# EAGLE design CNC Power V2[Конфликт] (EAGLE 7.5.0)
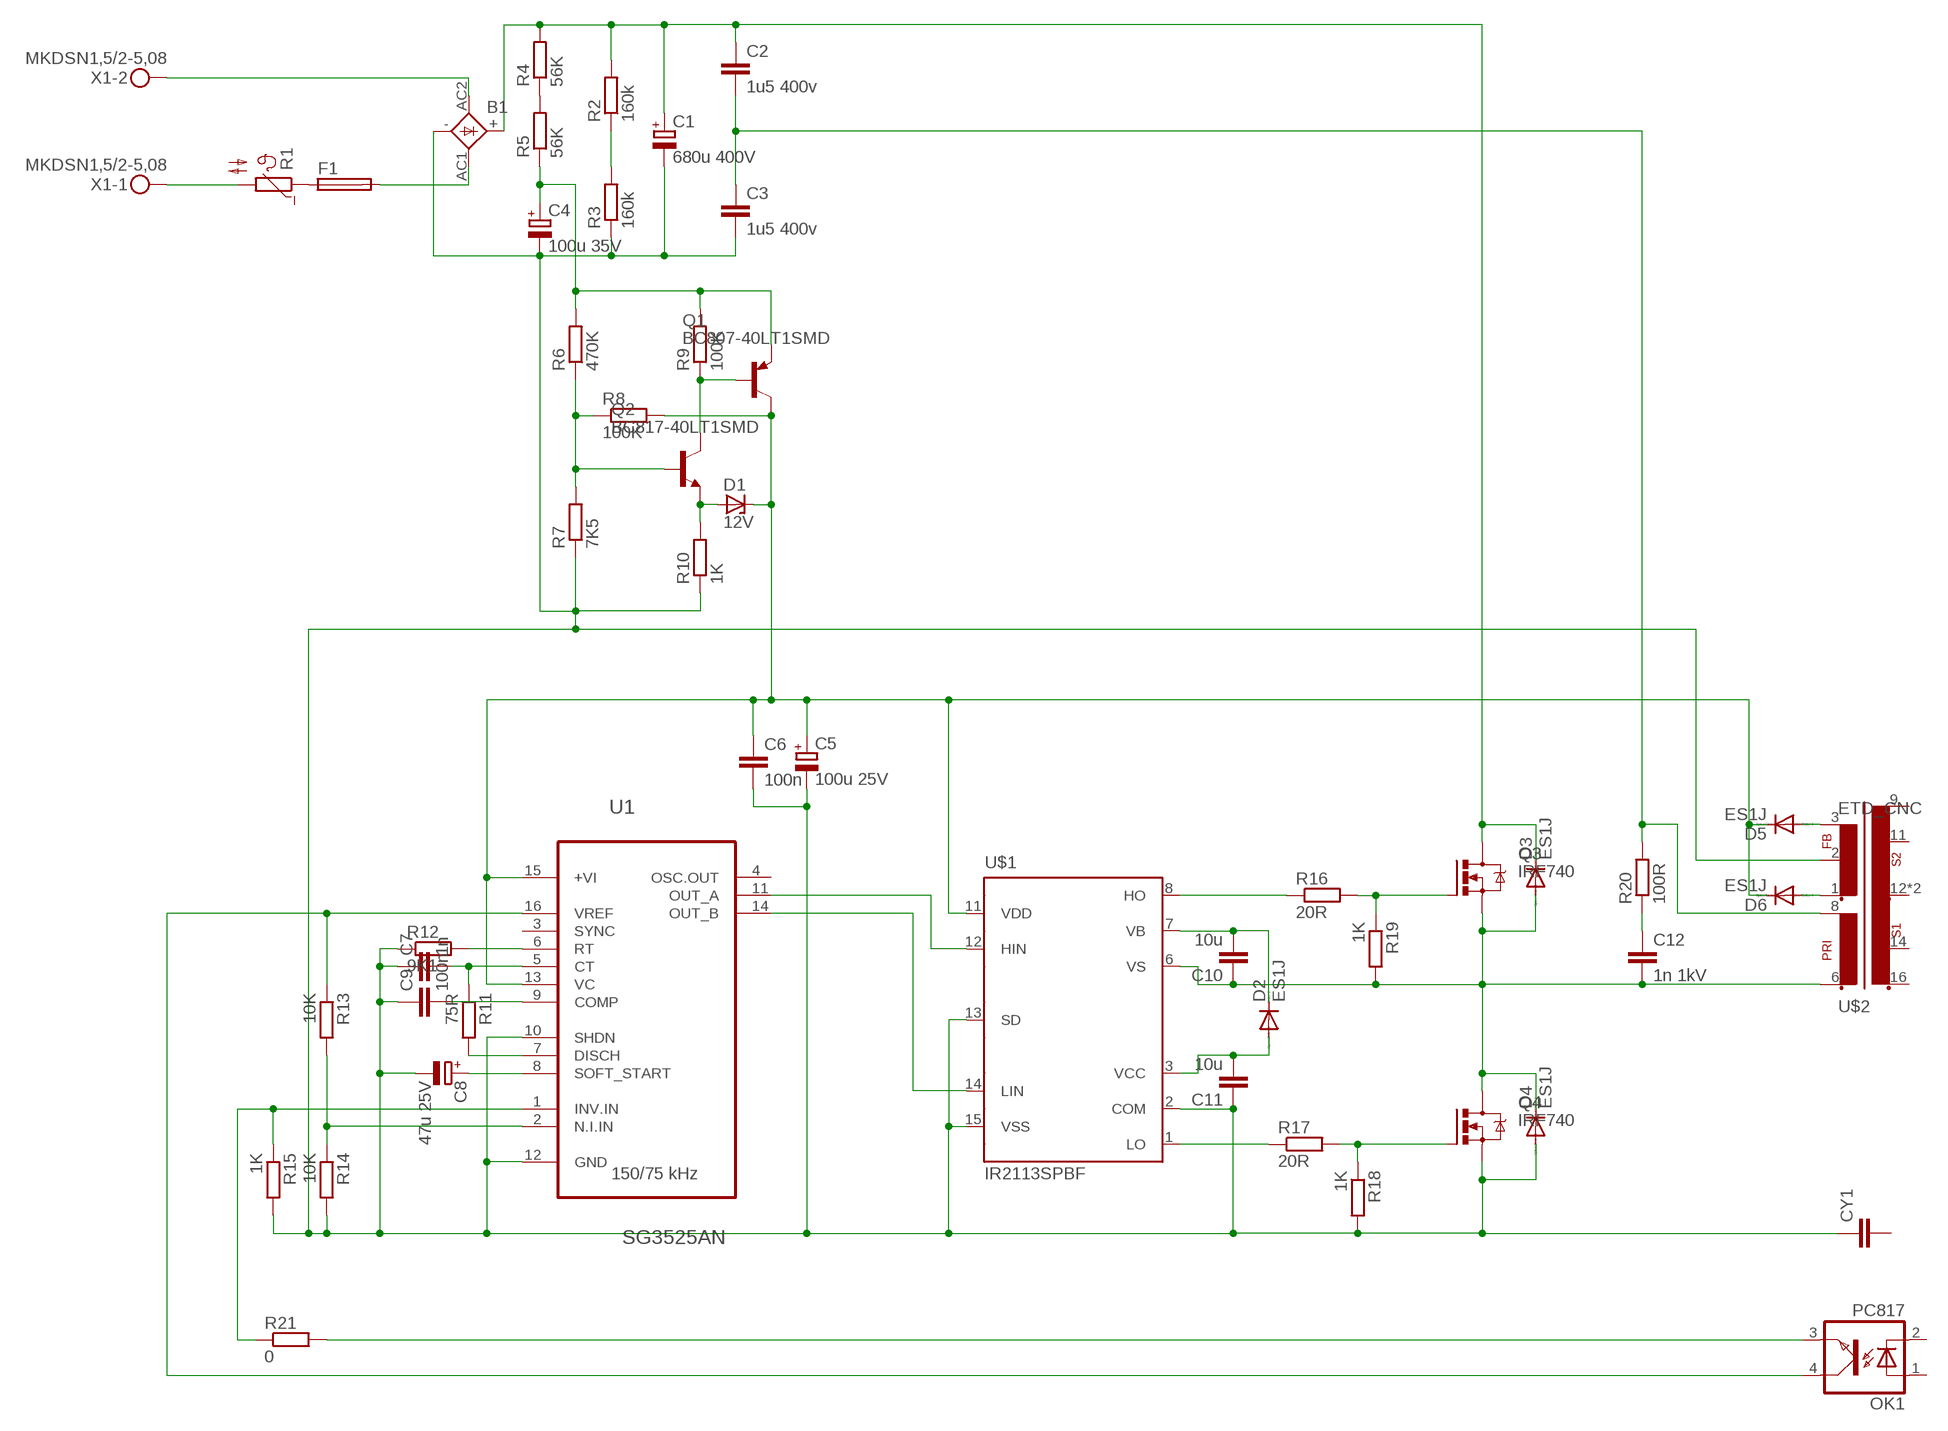
[diagram p0: schematic, sheet 1]

## Parts
B1  KBL  [KBL]
C1  680u 400V  CPOL-EUE10-35  [EB35D]
C2  1u5 400v  C-EU225-074X268  [C225-074X268]
C3  1u5 400v  C-EU225-074X268  [C225-074X268]
C4  100u 35V  CPOL-EUE2.5-7  [E2,5-7]
C5  100u 25V  CPOL-EUE2.5-7  [E2,5-7]
C6  100n  C-EUC0805  [C0805]
C7  1n  C-EUC0805  [C0805]
C8  47u 25V  CPOL-EUE2.5-7  [E2,5-7]
C9  100n  C-EUC0805  [C0805]
C10  10u  C-EUC0805  [C0805]
C11  10u  C-EUC0805  [C0805]
C12  1n 1kV  C-EU050-025X075  [C050-025X075]
CY1  CYYC10B4  [YC10B4]
D1  12V  ZENER-DIODESOD80C  [SOD80C]
D2  ES1J  DIODE-DO214AC  [DO214AC]
D3  ES1J  DIODE-DO214AC  [DO214AC]
D4  ES1J  DIODE-DO214AC  [DO214AC]
D5  ES1J  DIODE-DO214AC  [DO214AC]
D6  ES1J  DIODE-DO214AC  [DO214AC]
F1  SH22,5  [SH22,5]
OK1  PC817  [DIL04]
Q1  BC807-40LT1SMD  [SOT23-BEC]
Q2  BC817-40LT1SMD  [SOT23-BEC]
Q3  IRF740  [TO220BV]
Q4  IRF740  [TO220BV]
R1  B57164  [B57164]
R2  160k  R-EU_0207/10  [0207/10]
R3  160k  R-EU_0207/10  [0207/10]
R4  56K  R-EU_0617/17  [0617/17]
R5  56K  R-EU_0617/17  [0617/17]
R6  470K  R-EU_R0805  [R0805]
R7  7K5  R-EU_R0805  [R0805]
R8  100K  R-EU_R0805  [R0805]
R9  100K  R-EU_R0805  [R0805]
R10  1K  R-EU_R0805  [R0805]
R11  75R  R-EU_R0805  [R0805]
R12  9K1  R-EU_R0805  [R0805]
R13  10K  R-EU_R0805  [R0805]
R14  10K  R-EU_R0805  [R0805]
R15  1K  R-EU_R0805  [R0805]
R16  20R  R-EU_R1206  [R1206]
R17  20R  R-EU_R1206  [R1206]
R18  1K  R-EU_R0805  [R0805]
R19  1K  R-EU_R0805  [R0805]
R20  100R  R-EU_0617/17  [0617/17]
R21  0  R-EU_R1206  [R1206]
U1  SG3525AN  [DIP254P762X510-16]
U$1  IR2113SPBF  [SO16W]
U$2  ETD_CNC  [ETD39_16PIN]
X1  MKDSN1,5/2-5,08  [MKDSN1,5/2-5,08]

## Nets
12V: C5.+ C6.1 D1.C D5.C D6.C Q1.C R8.2 U1.13(VC) U1.15(+VI) U$1.11(VDD)
HV-0: B1.- C1.- C3.2 C4.- C5.- C6.2 C7.1 C8.- C9.1 C11.1 CY1.1 D4.A Q4.S R3.1 R7.1 R10.1 R12.1 R14.2 R15.2 R18.2 U1.10(SHDN) U1.12(GND) U$1.2(COM) U$1.13(SD) U$1.15(VSS) U$2.2(F0)
HV-150: C2.2 C3.1 R20.2 U$2.8(P-2)
HV-300: B1.+ C1.+ C2.1 D3.C Q3.D R2.2 R4.2
N$1: F1.1 R1.1
N$2: R1.2 X1.1
N$3: B1.AC1(AC2) F1.2
N$4: B1.AC2(AC1) X1.2
N$5: R16.1 U$1.8(HO)
N$6: R17.1 U$1.1(LO)
N$7: Q3.G R16.2 R19.1
N$8: R2.1 R3.2
N$9: R4.1 R5.2
N$10: C4.+ Q1.E R5.1 R6.2 R9.2
N$11: Q2.B R6.1 R7.2 R8.1
N$12: Q1.B Q2.C R9.1
N$13: OK1.3(EMIT) R21.2
N$14: D1.A Q2.E R10.2
N$15: C7.2 R11.1 U1.5(CT)
N$16: R11.2 U1.7(DISCH)
N$17: Q4.G R17.2 R18.1
N$18: U1.11(OUT_A) U$1.12(HIN)
N$19: U1.14(OUT_B) U$1.14(LIN)
N$20: R12.2 U1.6(RT)
N$21: C8.+ U1.8(SOFT_START)
N$22: C9.2 U1.9(COMP)
N$23: OK1.4(COL) R13.1 U1.16(VREF)
N$24: R13.2 R14.1 U1.2(N.I.IN)
N$25: R15.1 R21.1 U1.1(INV.IN)
N$28: D6.A U$2.1(F+12)
N$29: D5.A U$2.3(F-12)
N$30: C12.1 R20.1
VB: C10.2 D2.C U$1.7(VB)
VCC: C11.2 D2.A U$1.3(VCC)
VS: C10.1 C12.2 D3.A D4.C Q3.S Q4.D R19.2 U$1.6(VS) U$2.6(P-1)
Unconnected: CY1.2 OK1.1(A) OK1.2(C) U1.3(SYNC) U1.4(OSC.OUT) U$2.9(S-48) U$2.11(S-24) U$2.12(S-0) U$2.13(S-0) U$2.14(S1+24) U$2.16(S1+48)

## Notes on the sheet
- 150/75 kHz

## Library data of the parts
B1 = rectifier:KBL: DIOTEC RECTIFIER
C1 C4 C5 C8 = rcl:CPOL-EU: POLARIZED CAPACITOR, European symbol
C2 C3 C6 C7 C9-C12 = rcl:C-EU: CAPACITOR, European symbol
CY1 = rcl:CY: Y CAPACITOR for power line
D1 = diode:ZENER-DIODE: Z-Diode
D2-D6 = diode:DIODE-: DIODE
F1 = fuse:SH22,5: FUSE HOLDER grid 22,5 mm, OGN0031 8201, Schurter (Buerklin); MF: SCHURTER; MPN: 0031.8201; OC_FARNELL: 1162740; OC_NEWARK: 96F8317
OK1 = optocoupler:PC817: SHARP OPTO COUPLER; MPN: PC817X4J000F; OC_FARNELL: 9707727; OC_NEWARK: 97K7059
Q1 = transistor-pnp:BC807*: PNP Transistror
Q2 = transistor-npn:BC817*: NPN Transistor
Q3 Q4 = transistor-power:IRF740: N-CHANNEL MOS FET
R1 = ptc-ntc:B57164: SIEMENS NTC; MPN: B57164K474K52; OC_FARNELL: 9753451; OC_NEWARK: 29M3118
R2-R21 = rcl:R-EU_: RESISTOR, European symbol
U1 = ST Microelctronics_By_element14_Batch_1:SG3525AN: REGULATING PULSE WIDTH MODULATORS; MPN: SG3525AN; OC_FARNELL: 1564368; OC_NEWARK: 89K1506; PACKAGE: PDIP-16; SUPPLIER: STMICROELECTRONICS
U$1 = Namenlos:IR2113SPBF
U$2 = _Transformers:ETD_CNC
X1 = con-phoenix-508:MKDSN1,5/2-5,08: MKDSN 1,5/ 2-5,08 Printklemme Nennstrom: 13,5 A Nennspannung: 250 V Rastermaß: 5,08 mm Polzahl: 2 Anschlussart: Schraubanschluss Montage: Löten Anschlussrichtung Leiter/Platine: 0 ° Artikelnummer: 1729128 Source: http://eshop.phoenixcontact.com .. 1729128.pdf

## Board
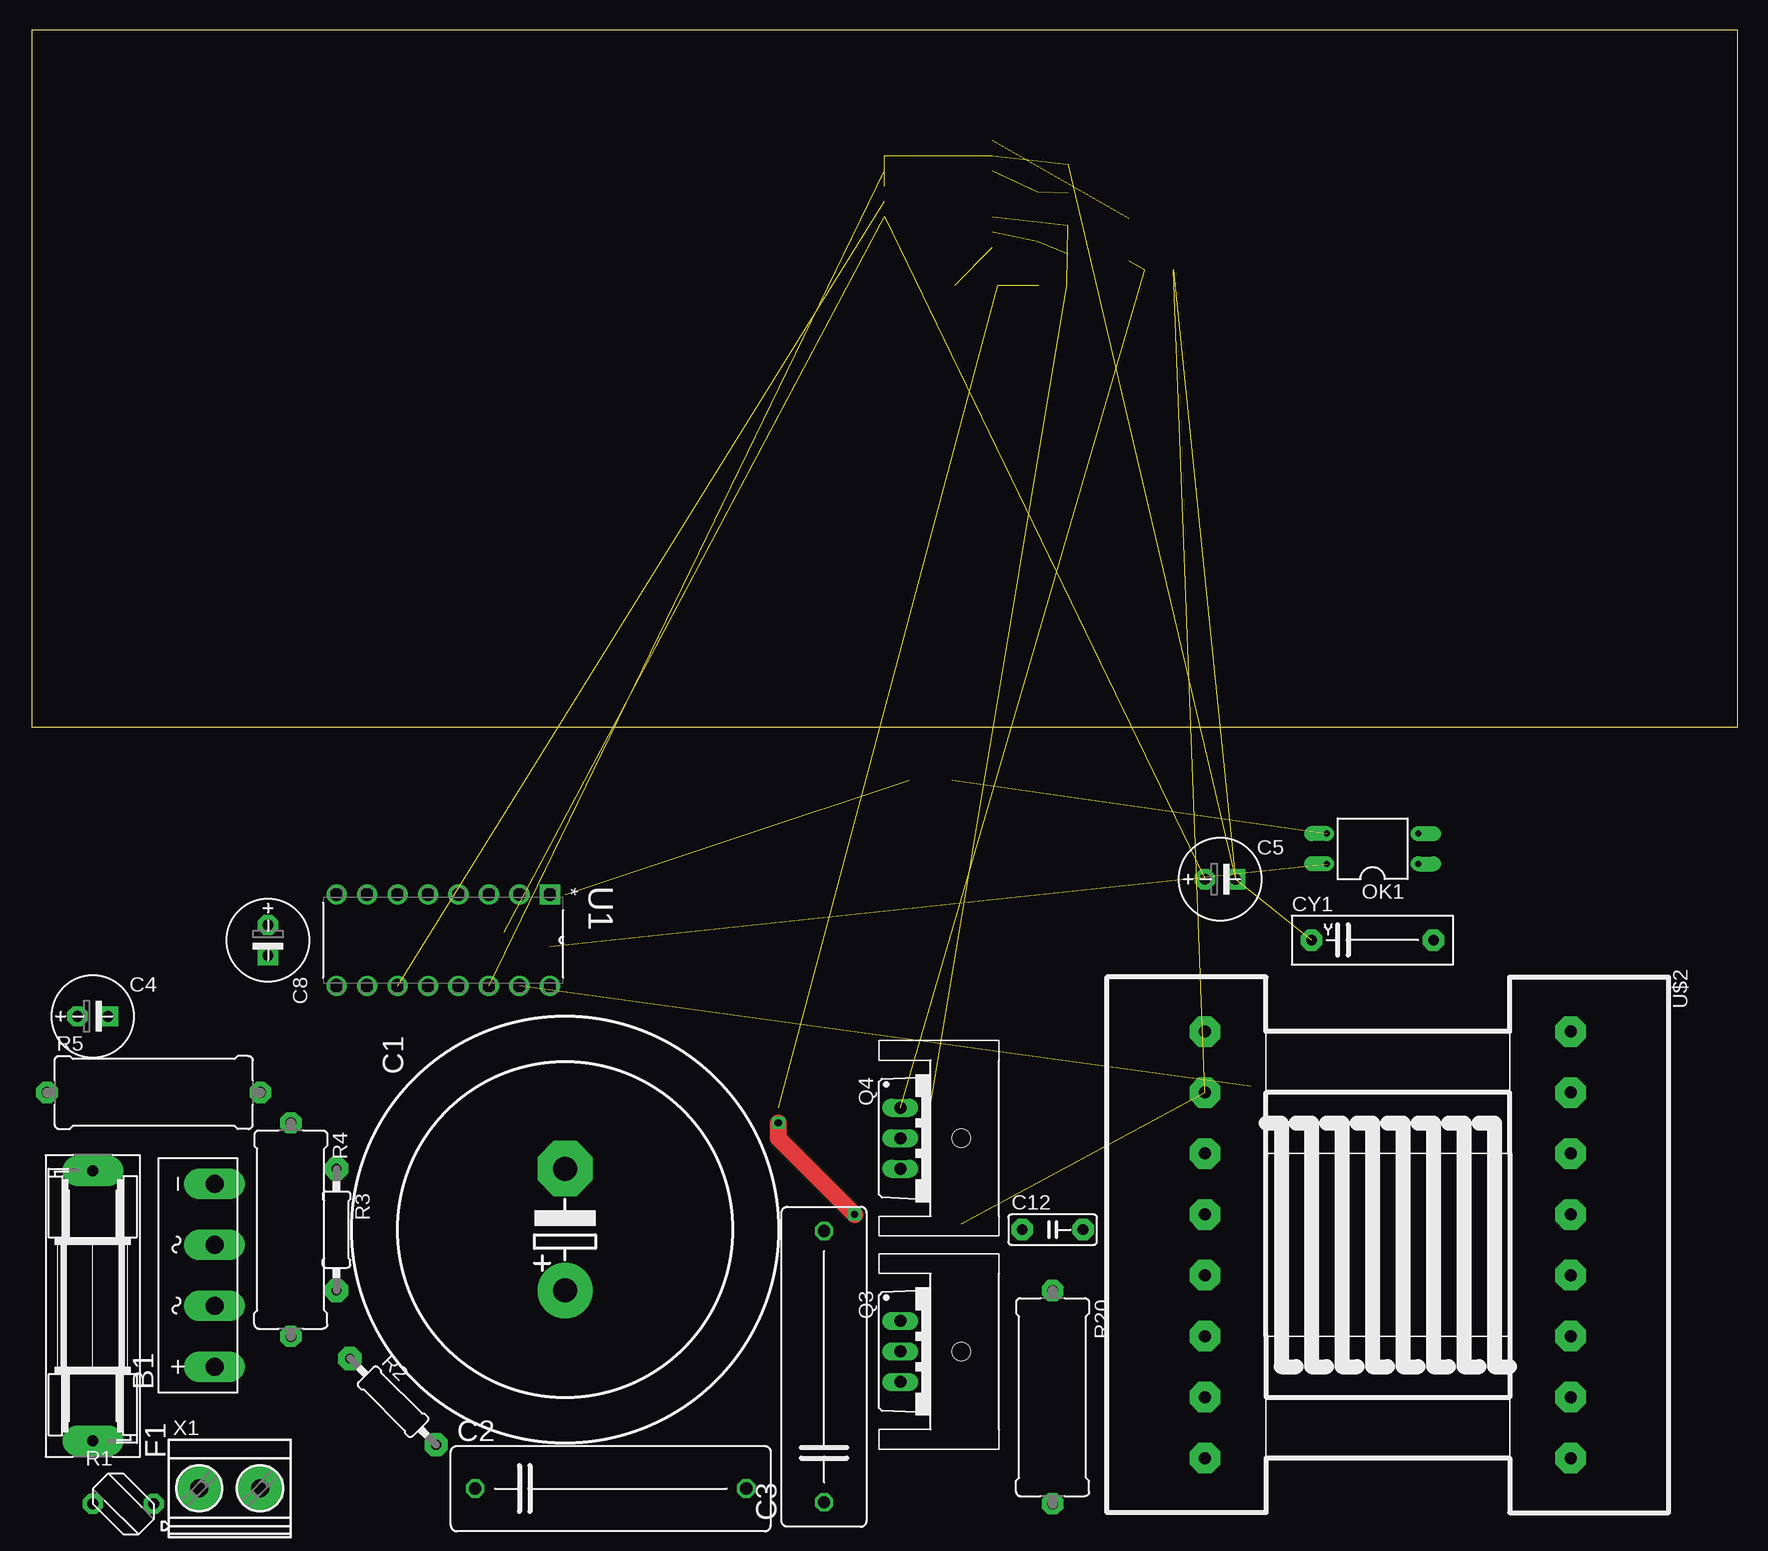
[diagram p1: board, top side]
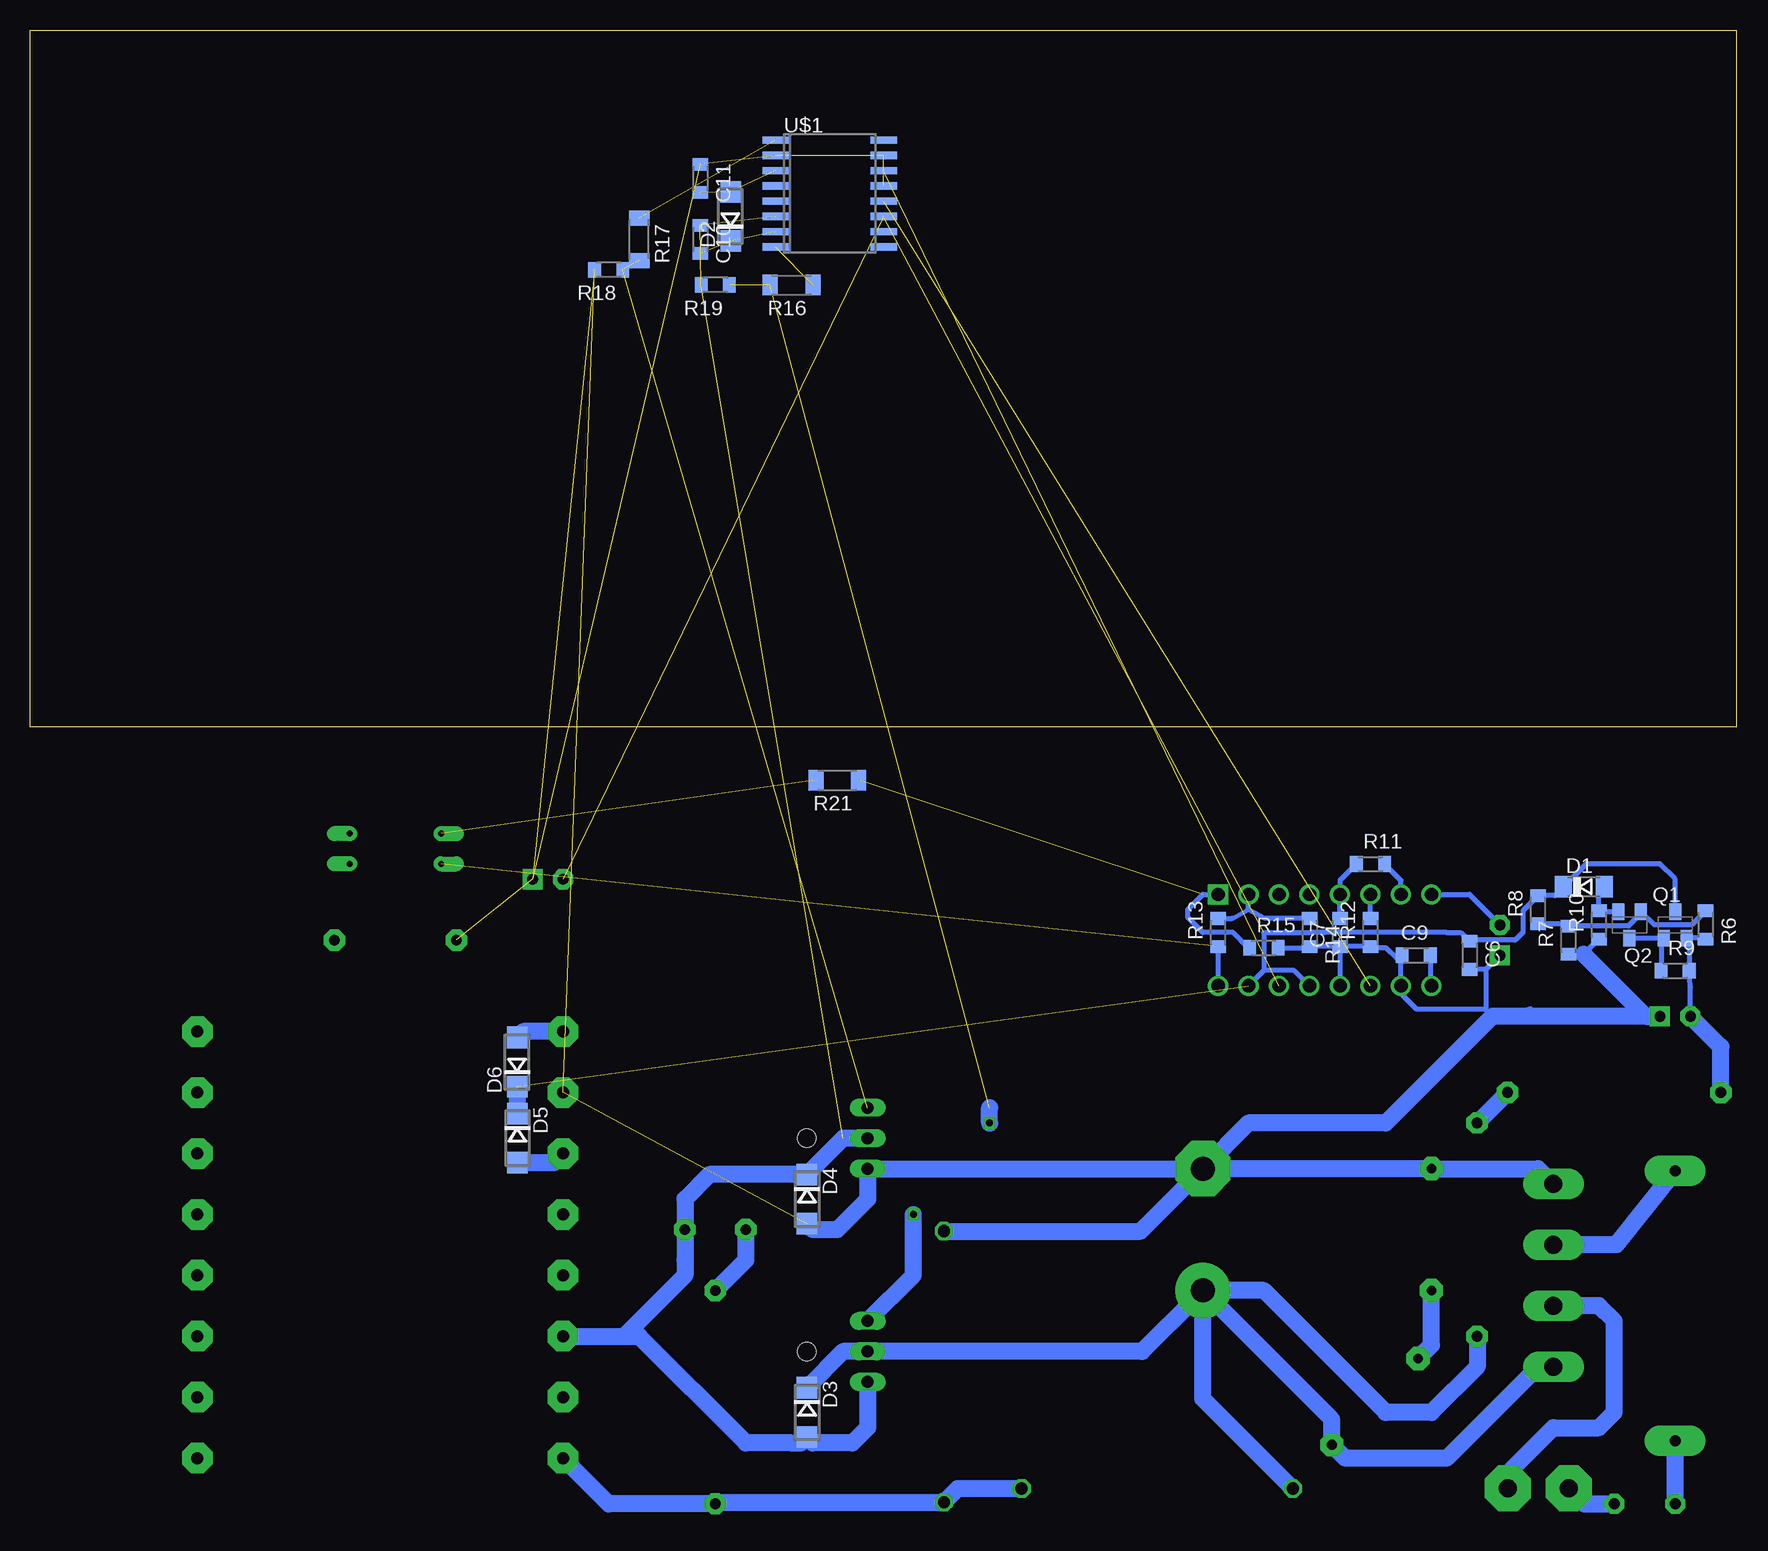
[diagram p2: board, bottom side, seen from below]

Size 142.22 x 58.09 mm. Coordinates in mm from the lower left corner, seen from the top.
Outline: 0,0 142.22,0 142.22,58.09 0,58.09 0,0
Copper layers (1*16): Top 0.035mm / dielectric 1.5mm / Bottom 0.035mm
Design rules "default": minimum track width 10mil, minimum drill 24mil, track to track 8mil, track to pad 8mil, pad to pad 8mil, via to via 8mil, smd to smd 8mil, copper to edge 40mil, drill to drill 8mil, minimum pad ring 10mil, minimum via ring 8mil, stop-mask expansion 4mil, vias tented up to drill 0mil, thermal gap 10mil

### Footprints (pad centres in the part's own frame; a part is rotated, then mirrored left to right if it is on the bottom)
KBL = drill 1.5 pad 2.54 long: + -7.62,-1.27; - 7.62,-1.27; AC1 2.54,-1.27; AC2 -2.54,-1.27
EB35D = drill 2.007 pad 4.597: + -5.08,0 | drill 2.007 pad 4.597 octagon: - 5.08,0
C225-074X268 = drill 1.016 octagon: 1 -11.303,0; 2 11.303,0
E2,5-7 = drill 0.9 pad 1.676 octagon: + -1.27,0 | drill 0.9 pad 1.676 square: - 1.27,0
C0805 = smd 1.05 x 1.3: 1 -1.175,0; 2 1.175,0
C050-025X075 = drill 0.9 pad 1.778 octagon: 1 -2.54,0; 2 2.54,0
YC10B4 = drill 0.9 pad 1.778 octagon: 1 -5.08,0; 2 5.08,0
SOD80C = smd 1.4 x 1.8: A 1.7,0; C -1.7,0
DO214AC = smd 1.8 x 1.7: A 2.05,0; C -2.05,0
SH22,5 = drill 0.9 pad 2.54 long: 1 -11.252,0; 2 11.252,0
DIL04 = drill 0.5 pad 1.27 offset: 1 -1.27,-3.81; 2 1.27,-3.81; 3 1.27,3.81; 4 -1.27,3.81
SOT23-BEC = smd 1 x 1.4: B -0.95,-1.1; C 0,1.1; E 0.95,-1.1
TO220BV = drill 1 pad 1.422 long: D 0,-2.54; G -2.54,-2.54; S 2.54,-2.54
B57164 = drill 0.9 pad 1.676 octagon: 1 -2.54,0; 2 2.54,0
0207/10 = drill 0.8 pad 1.93 octagon: 1 -5.08,0; 2 5.08,0
0617/17 = drill 0.9 pad 1.778 octagon: 1 -8.89,0; 2 8.89,0
R0805 = smd 1.05 x 1.3: 1 -1.175,0; 2 1.175,0
R1206 = smd 1.25 x 1.7: 1 -1.775,0; 2 1.775,0
DIP254P762X510-16 = drill 1.118 square: 1 -7.62,17.78 | drill 1.118: 2 -7.62,15.24; 3 -7.62,12.7; 4 -7.62,10.16; 5 -7.62,7.62; 6 -7.62,5.08; 7 -7.62,2.54; 8 -7.62,0; 9 0,0; 10 0,2.54; 11 0,5.08; 12 0,7.62; 13 0,10.16; 14 0,12.7; 15 0,15.24; 16 0,17.78
SO16W = smd 0.6 x 2.2: 1 -4.445,-4.505; 2 -3.175,-4.505; 3 -1.905,-4.505; 4 -0.635,-4.505; 5 0.635,-4.505; 6 1.905,-4.505; 7 3.175,-4.505; 8 4.445,-4.505; 9 4.445,4.505; 10 3.175,4.505; 11 1.905,4.505; 12 0.635,4.505; 13 -0.635,4.505; 14 -1.905,4.505; 15 -3.175,4.505; 16 -4.445,4.505
ETD39_16PIN = drill 1 pad 2.54 octagon: 1 -17.78,-15.24; 2 -12.7,-15.24; 3 -7.62,-15.24; 4 -2.54,-15.24; 5 2.54,-15.24; 6 7.62,-15.24; 7 12.7,-15.24; 8 17.78,-15.24; 9 17.78,15.24; 10 12.7,15.24; 11 7.62,15.24; 12 2.54,15.24; 13 -2.54,15.24; 14 -7.62,15.24; 15 -12.7,15.24; 16 -17.78,15.24
SK95-3M3_HOLE = hole 1.5: 0,2.54
MKDSN1,5/2-5,08 = drill 1.5 pad 3.81 octagon: 1 -2.561,0.025; 2 2.519,0.025

### Placement (x,y rotation side)
B1  13.97,-45.72 90 top  (outside the outline)
C1  44.45,-41.91 90 top  (outside the outline)
C2  48.26,-63.5 0 top  (outside the outline)
C3  66.04,-53.34 90 top  (outside the outline)
C4  5.08,-24.13 0 top  (outside the outline)
C5  99.06,-12.7 0 top  (outside the outline)
C6  22.23,-19.05 270 bottom  (outside the outline)
C7  33.02,-17.14 90 bottom  (outside the outline)
C8  19.68,-17.78 270 top  (outside the outline)
C9  26.67,-19.05 0 bottom  (outside the outline)
C10  86.36,40.64 270 bottom
C11  86.36,45.72 270 bottom
C12  85.09,-41.91 0 top  (outside the outline)
CY1  111.76,-17.78 0 top  (outside the outline)
D1  12.7,-13.34 0 bottom  (outside the outline)
D2  83.82,42.55 90 bottom
D3  77.47,-57.15 270 bottom  (outside the outline)
D4  77.47,-39.37 270 bottom  (outside the outline)
D5  101.6,-34.29 270 bottom  (outside the outline)
D6  101.6,-27.94 90 bottom  (outside the outline)
F1  5.08,-48.26 90 top  (outside the outline)
OK1  111.76,-10.16 90 top  (outside the outline)
Q1  5.08,-16.51 0 bottom  (outside the outline)
Q2  8.89,-16.51 180 bottom  (outside the outline)
Q3  74.93,-52.07 270 top  (outside the outline)
Q4  74.93,-34.29 270 top  (outside the outline)
R1  7.62,-64.77 0 top  (outside the outline)
R2  30.11,-56.25 315 top  (outside the outline)
R3  25.4,-41.91 270 top  (outside the outline)
R4  21.59,-41.91 270 top  (outside the outline)
R5  10.16,-30.48 0 top  (outside the outline)
R6  2.54,-16.51 270 bottom  (outside the outline)
R7  13.97,-17.78 90 bottom  (outside the outline)
R8  16.51,-15.24 90 bottom  (outside the outline)
R9  5.08,-20.32 0 bottom  (outside the outline)
R10  11.43,-16.51 90 bottom  (outside the outline)
R11  30.48,-11.43 0 bottom  (outside the outline)
R12  30.48,-17.14 90 bottom  (outside the outline)
R13  43.18,-17.14 90 bottom  (outside the outline)
R14  35.56,-17.14 270 bottom  (outside the outline)
R15  39.37,-18.41 0 bottom  (outside the outline)
R16  78.74,36.83 180 bottom
R17  91.44,40.64 270 bottom
R18  93.98,38.1 180 bottom
R19  85.09,36.83 180 bottom
R20  85.09,-55.88 270 top  (outside the outline)
R21  74.93,-4.45 180 bottom  (outside the outline)
U1  25.4,-21.59 270 top  (outside the outline)
U$1  75.56,44.45 270 bottom
U$2  113.03,-43.18 270 top  (outside the outline)
U$3  [SK95-3M3_HOLE]  74.93,-52.07 270 top  (outside the outline)
U$4  [SK95-3M3_HOLE]  74.93,-34.29 270 top  (outside the outline)
X1  16.51,-63.5 0 top  (outside the outline)

### Tracks (layer width: path | path; a pad name or v marks a point on that pad's centre or on a via)
12V  (3 unrouted)
  Bottom 0.406: Q1.C 5.08,-12.7 6.35,-11.43 12.49,-11.43 D1.C | D1.C 14.94,-12.79 | D1.C 15.13,-14.06 R8.2 17.78,-15.34 17.78,-16.51 17.78,-17.14 18.41,-17.78 22.13,-17.78 C6.1 22.95,-17.14 24.13,-17.14 34.29,-17.14 35.56,-17.14 38.1,-17.14 39.37,-17.14 39.37,-20.32 | 39.37,-20.32 U1.15 | U1.13 36.83,-20.32 39.37,-20.32
  Bottom 1.422: D6.C D5.C
HV-0  (8 unrouted)
  Bottom 0.406: 10.06,-24.13 8.89,-24.13 7.62,-24.13 | 12.7,-18.95 R7.1 | R10.1 12.65,-18.91 12.65,-19 | 17.14,-23.5 19.05,-24.13 | C7.1 R12.1 30.39,-18.41 29.21,-18.41 28.26,-19.37 | C7.1 U1.12 | 28.26,-19.37 27.94,-19.68 U1.10 27.94,-22.23 26.67,-23.5 20.95,-23.5 | C7.1 R14.2 35.66,-18.41 R15.2 | C9.1 27.94,-19.05 28.26,-19.37 | C8.- 20.86,-20.23 | 20.86,-20.23 C6.2 | 20.95,-23.5 20.32,-24.13 | 20.86,-20.23 20.86,-23.4 20.95,-23.5
  Bottom 1.422: D4.A 76.98,-41.91 74.93,-41.91 72.39,-39.37 Q4.S C1.- | C1.- R3.1 16.51,-36.83 B1.- | C3.2 49.66,-42.04 C1.- | C1.- 40.64,-33.02 29.21,-33.02 20.32,-24.13 19.05,-24.13 12.7,-24.13 8.89,-24.13 7.62,-24.13 C4.- 7.53,-24.13 12.65,-19 12.7,-18.95
HV-150
  Bottom 1.422: U$2.8 93.98,-64.77 R20.2 84.96,-64.64 C3.1 64.9,-63.5 C2.2
HV-300
  Bottom 1.422: D3.C 74.44,-52.07 Q3.D 49.53,-52.07 45.09,-47.62 | C1.+ 33.7,-57.74 R2.2 32.58,-60.96 24.13,-60.96 16.51,-53.34 B1.+ | C1.+ 45.09,-47.62 | C2.1 44.45,-56.01 C1.+ | R4.2 21.59,-53.34 25.4,-57.15 29.21,-57.15 39.37,-46.99 C1.+ | C1.+ 45.09,-47.62
N$1
  Bottom 1.422: R1.1 F1.1
N$2
  Bottom 1.422: X1.1 12.65,-64.77 R1.2
N$3
  Bottom 1.422: F1.2 9.98,-43.18 B1.AC1
N$4
  Bottom 1.422: X1.2 19.03,-62.21 15.24,-58.42 11.43,-58.42 10.16,-57.15 10.16,-49.53 11.43,-48.26 B1.AC2 | B1.AC2 16.51,-48.26 B1.AC2
N$5  (1 unrouted)
N$6  (1 unrouted)
N$7  (via drill 0.6)  (2 unrouted)
  Top 1.422: v68.58,-40.64 62.23,-34.29 v62.23,-33.02
  Bottom 1.422: Q3.G 68.58,-45.72 v68.58,-40.64 | v62.23,-33.02 62.23,-31.75
N$8
  Bottom 1.422: R2.1 25.4,-51.54 R3.2
N$9
  Bottom 1.422: R5.2 R4.1
N$10
  Bottom 0.406: C4.+ 3.81,-21.68 R9.2 3.9,-17.84 Q1.E 2.62,-17.61 R6.2
  Bottom 1.422: R5.1 1.27,-26.67 C4.+
N$11
  Bottom 0.406: R6.1 3.71,-16.51 3.81,-16.51 6.84,-16.51 Q2.B 7.94,-15.56 8.89,-16.51 8.98,-16.61 R7.2 14.16,-16.41 R8.1
N$12
  Bottom 0.406: R9.1 6.25,-17.84 Q1.B Q2.C
N$13  (1 unrouted)
N$14
  Bottom 0.406: Q2.E 11.36,-15.41 R10.2 11.43,-13.13 D1.A
N$15
  Bottom 0.406: C7.2 U1.5 33.02,-12.79 R11.1
N$16
  Bottom 0.406: U1.7 27.94,-12.79 R11.2
N$17  (2 unrouted)
N$18  (1 unrouted)
N$19  (1 unrouted)
N$20
  Bottom 0.406: R12.2 U1.6
N$21
  Bottom 0.406: U1.8 22.23,-13.97 C8.+
N$22
  Bottom 0.406: C9.2 25.5,-21.5 U1.9
N$23  (1 unrouted)
  Bottom 0.406: R13.1 U1.16
N$24
  Bottom 0.406: R14.1 39.27,-15.97 40.64,-15.24 | 40.64,-15.24 U1.2 | R13.2 42.01,-15.97 40.64,-15.24
N$25  (1 unrouted)
  Bottom 0.406: R15.1 40.64,-18.41 41.91,-17.14 44.45,-17.14 45.72,-15.88 45.72,-15.24 44.45,-13.97 U1.1
N$28
  Bottom 1.422: U$2.1 101.11,-25.4 D6.A
N$29
  Bottom 1.422: U$2.3 98.57,-36.34 D5.A
N$30
  Bottom 1.422: R20.1 82.55,-44.45 C12.1
VB  (2 unrouted)
VCC  (2 unrouted)
VS  (3 unrouted)
  Bottom 1.422: Q3.S 72.39,-58.42 73.66,-59.69 76.98,-59.69 D3.A 77.96,-59.69 78.74,-59.69 82.55,-59.69 91.44,-50.8 92.71,-50.8 | Q4.D 74.44,-34.29 D4.C 85.58,-37.32 87.63,-39.37 C12.2 87.63,-44.45 87.63,-45.72 92.71,-50.8 | U$2.6 92.71,-50.8